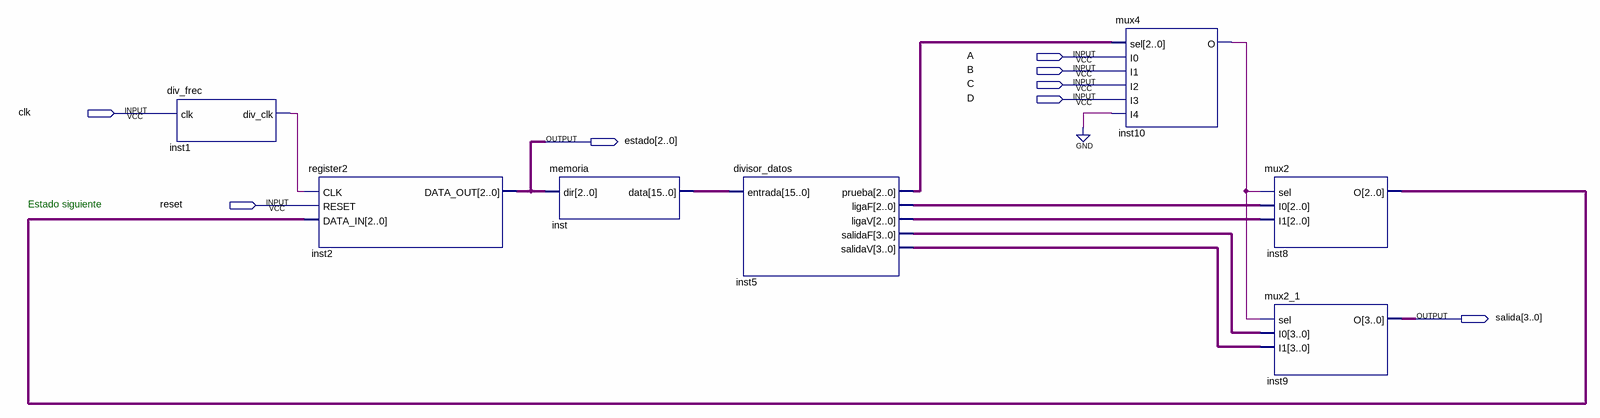
[diagram p0: schematic sheet]
// Quartus schematic practica4.bdf as structural Verilog: 7 symbols, 8 pins
module practica4 (
  input  A,
  input  B,
  input  C,
  input  D,
  input  clk,
  input  reset,
  output [2:0] estado,
  output [3:0] salida
);

  wire inst1_div_clk, inst10_o;
  wire [2:0] inst5_ligaf, inst5_ligav, inst5_prueba, inst8_o;
  wire [3:0] inst5_salidaf, inst5_salidav;
  wire [15:0] inst_data;

  div_frec inst1 (.clk(clk), .div_clk(inst1_div_clk));
  register2 inst2 (.CLK(inst1_div_clk), .RESET(reset), .DATA_IN(inst8_o), .DATA_OUT(estado));
  memoria inst (.dir(estado), .data(inst_data));
  divisor_datos inst5 (
    .entrada(inst_data), .prueba(inst5_prueba), .ligaF(inst5_ligaf), .ligaV(inst5_ligav),
    .salidaF(inst5_salidaf), .salidaV(inst5_salidav));
  mux4 inst10 (.sel(inst5_prueba), .I0(A), .I1(B), .I2(C), .I3(D), .I4(1'b0), .O(inst10_o));
  mux2 inst8 (.sel(inst10_o), .I0(inst5_ligaf), .I1(inst5_ligav), .O(inst8_o));
  mux2_1 inst9 (.sel(inst10_o), .I0(inst5_salidaf), .I1(inst5_salidav), .O(salida));

  // Notes on the sheet:
  //   Estado siguiente
endmodule
